# EasyEDA schematic SCH_d_01_e_02.json
TITLE: Sheet_1; REV: 1.0; Date: 2025-01-14; Sheet: 1/1; Drawn By: artem.v.ulyanov; Company: Your Company
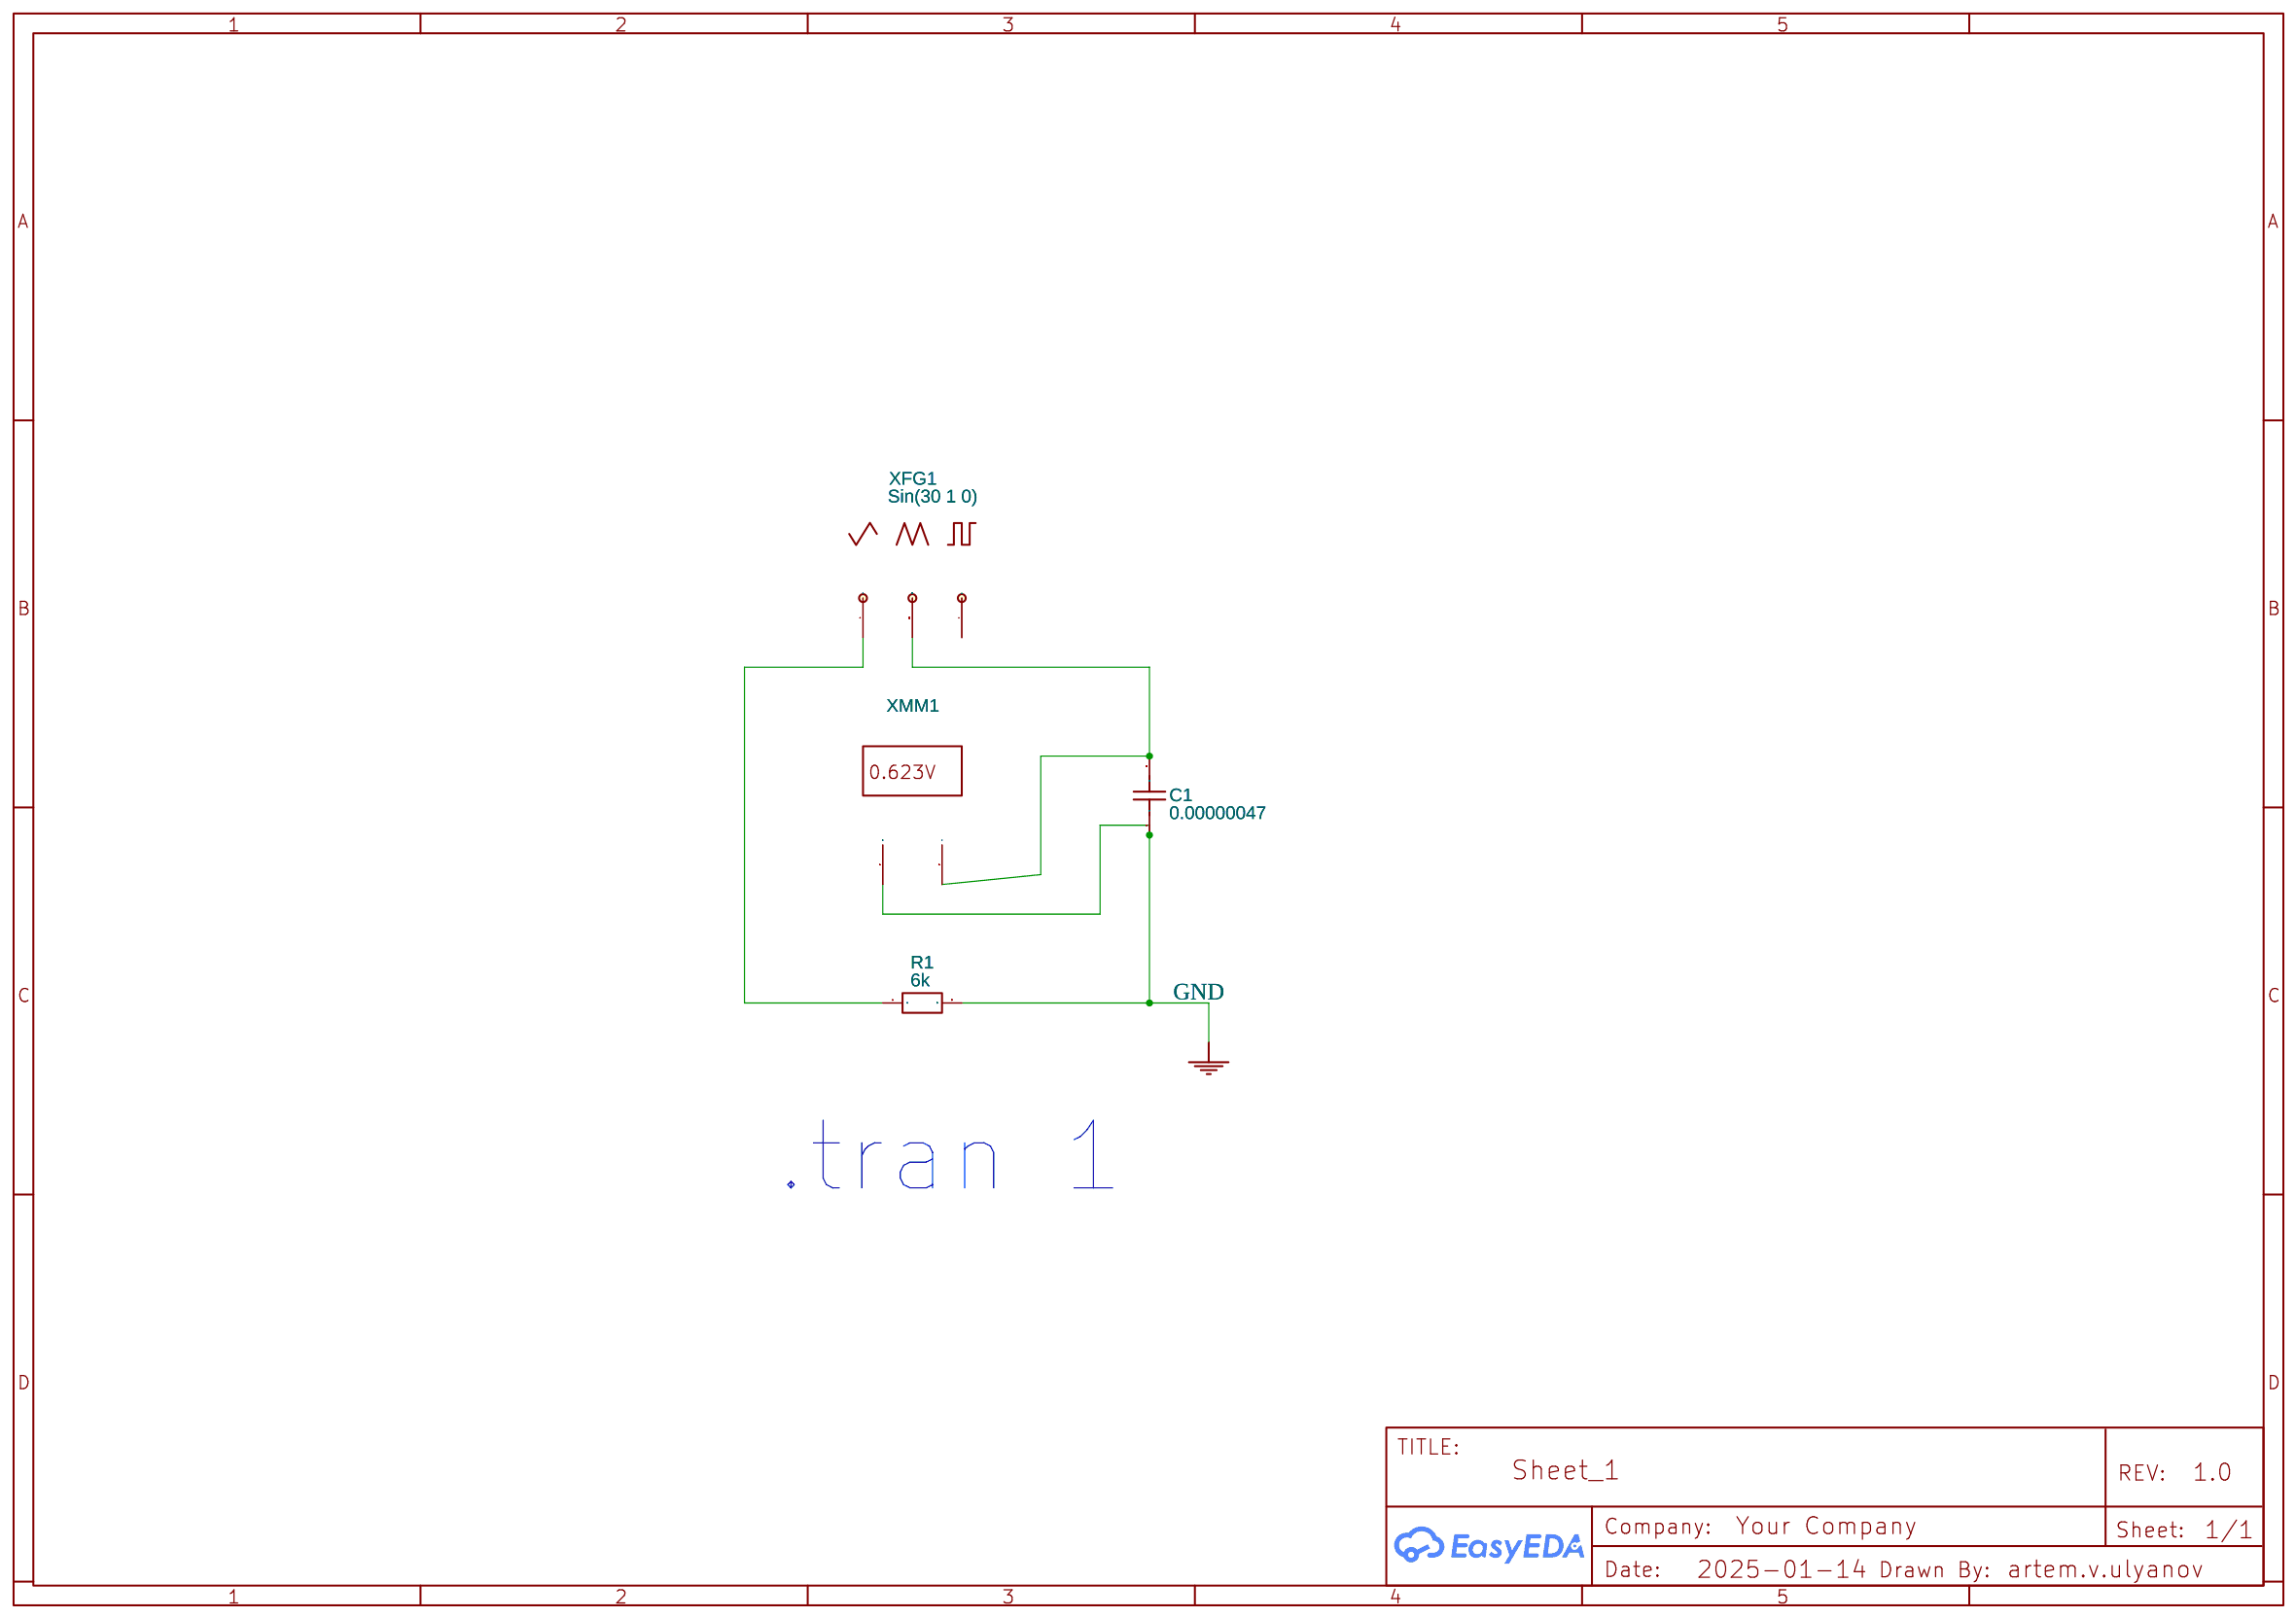
[diagram p0: schematic sheet]

## Parts
C1  0.00000047  [RAD-0.1]
R1  6k  [R0603]
XFG1  Sin(30 1 0)
XMM1  Multimeter

## Library data of the parts
C1 = Capacitor_US: Contributor: EasyEDA; Supplier: YUJING; Capacitance: 1u
R1 = R_0603_EU: Contributor: LCEDA_Lib
XFG1 = FUNCTIONGENERATOR: Supplier: LCSC; Waveforms: Sine Wave; Frequency: 30; Duty cycle: 50; Amplitude: 1; Offset: 0; Rise/Fall Time: 10; NameDisplay: 1; Contributor: EasyEDA; sim: true
XMM1 = MULTIMETER: Supplier: LCSC; Multimeter Type: Voltmeter; Power Type: AC; Voltmeter resistance: 10μ; Ammeter resistance: 1G; NameDisplay: 0; Contributor: EasyEDA; sim: true

## Nets
GND: C1.1 R1.2 XMM1.1(+)
Net-(C1-2): C1.2 XFG1.COM XMM1.2(I)
Net-(R1-1): R1.1 XFG1.+

Not connected (* = marked no-connect by the designer): XFG1 -

## Notes on the sheet
- .tran 1
